# Altium schematic sheet 08_PERIPHERAL.SchDoc
size A4
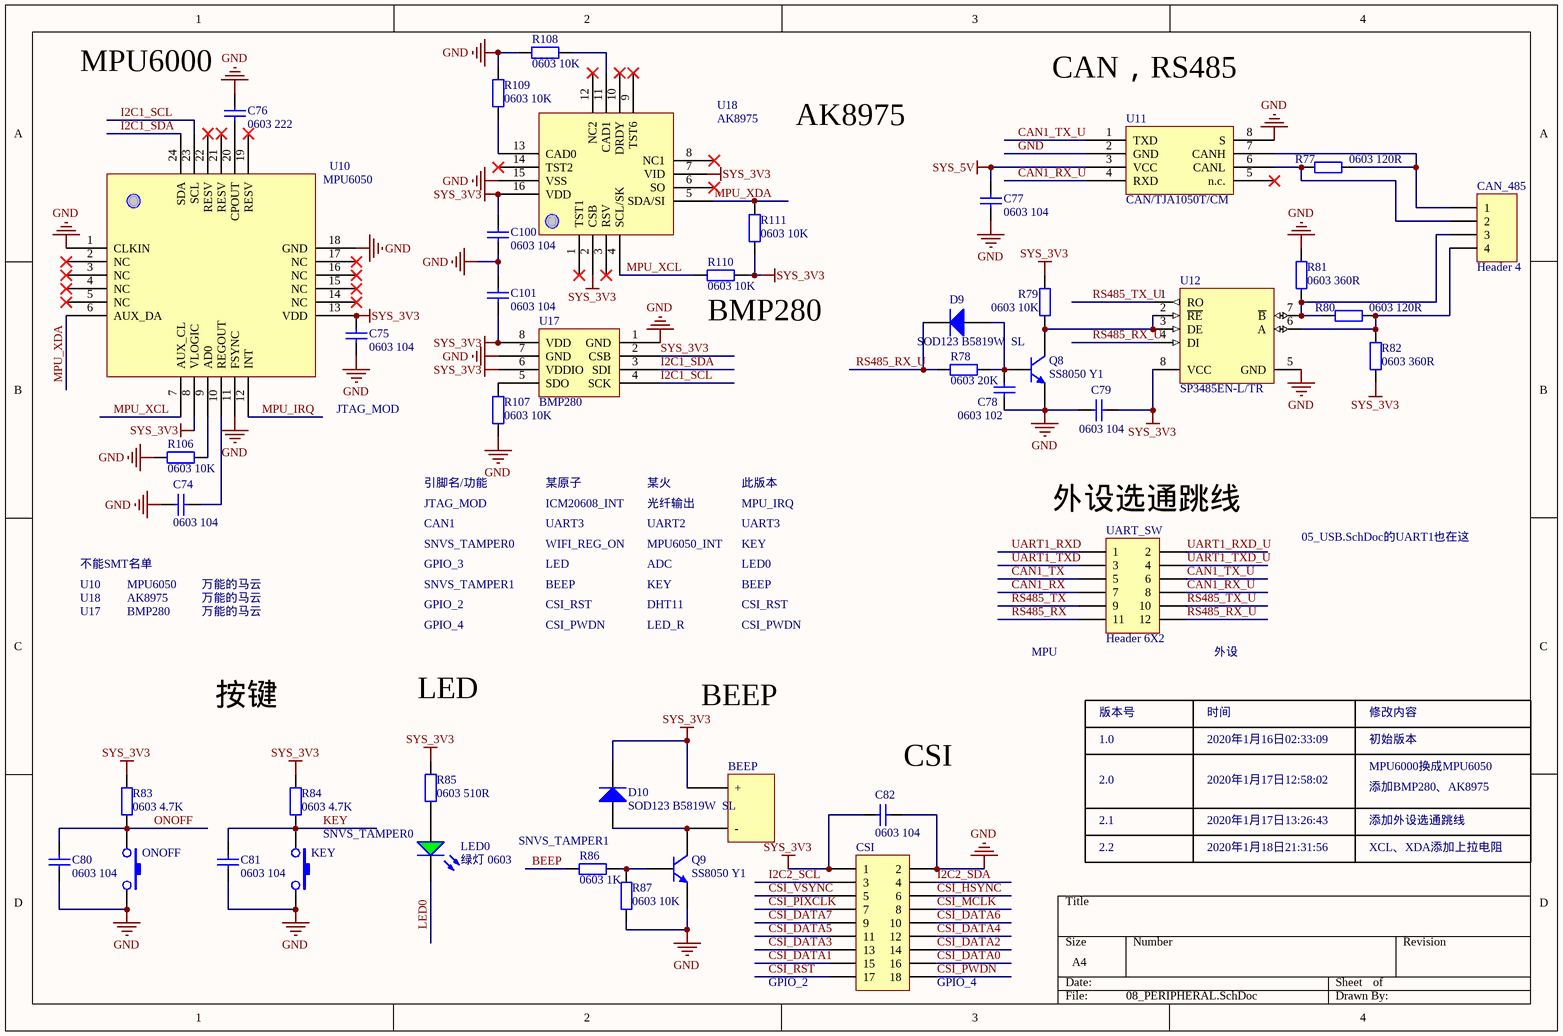
[diagram p0: 08_PERIPHERAL.SchDoc]

## Parts
BEEP  (no value)  [BEEP]
C74  0603 104  [LC-0603_C]
C75  0603 104  [LC-0603_C]
C76  0603 222  [LC-0603_C]
C77  0603 104  [LC-0603_C]
C78  0603 102  [LC-0603_C]
C79  0603 104  [LC-0603_C]
C80  0603 104  [LC-0603_C]
C81  0603 104  [LC-0603_C]
C82  0603 104  [LC-0603_C]
C100  0603 104  [LC-0603_C]
C101  0603 104  [LC-0603_C]
CAN_485  Header 4  [HDR1X4]
CSI  (no value)  [HDR2X9]
D9  SOD123 B5819W  SL  [LC-SOD-123]
D10  SOD123 B5819W  SL  [LC-SOD-123]
KEY  (no value)  [KEY2]
LED0  绿灯 0603  [LC-0603_LED_S1]
ONOFF  (no value)  [KEY2]
Q8  SS8050 Y1  [LC-SOT-23(SOT-23-3)]
Q9  SS8050 Y1  [LC-SOT-23(SOT-23-3)]
R77  0603 120R  [LC-0603_R]
R78  0603 20K  [LC-0603_R]
R79  0603 10K  [LC-0603_R]
R80  0603 120R  [LC-0603_R]
R81  0603 360R  [LC-0603_R]
R82  0603 360R  [LC-0603_R]
R83  0603 4.7K  [LC-0603_R]
R84  0603 4.7K  [LC-0603_R]
R85  0603 510R  [LC-0603_R]
R86  0603 1K  [LC-0603_R]
R87  0603 10K  [LC-0603_R]
R106  0603 10K  [LC-0603_R]
R107  0603 10K  [LC-0603_R]
R108  0603 10K  [LC-0603_R]
R109  0603 10K  [LC-0603_R]
R110  0603 10K  [LC-0603_R]
R111  0603 10K  [LC-0603_R]
U10  MPU6050  [QFN-24_4x4x05P]
U11  CAN/TJA1050T/CM  [LC-SOIC-8_150mil]
U12  SP3485EN-L/TR  [LC-SOIC-8_150mil]
U17  BMP280  [BMP280]
U18  AK8975  [QFN16(4mm)]
UART_SW  Header 6X2  [HDR2X6]

## Nets
GND: C74.1 C75.1 C76.2 C77.1 C78.2 C79.1 C80.1 C81.1 C82.1 C100.2 C101.1 CSI.2 KEY.2 ONOFF.2 Q8.2(E) Q9.2(E) R81.2 R87.2 R106.1 R107.1 R108.2 R109.1 U10.1(CLKIN) U10.11(FSYNC) U10.18(GND) U11.2(GND) U11.8(S) U12.5(GND) U17.1(GND) U17.7(GND) U18.15(VSS)
SYS_3V3: BEEP.+ C75.2 C79.2 C82.2 C100.1 C101.2 CSI.1 D10.2(K) R79.1 R82.1 R83.2 R84.2 R85.2 R110.2 R111.2 U10.8(VLOGIC) U10.13(VDD) U12.8(VCC) U17.2(CSB) U17.6(VDDIO) U17.8(VDD) U18.2(CSB) U18.16(VDD)
SYS_5V: C77.2 U11.3(VCC)
BEEP: R86.2
CAN1_RX: UART_SW.7
CAN1_RX_U: U11.4(RXD) UART_SW.8
CAN1_TX: UART_SW.5
CAN1_TX_U: U11.1(TXD) UART_SW.6
CSI_DATA0: CSI.16
CSI_DATA1: CSI.15
CSI_DATA2: CSI.14
CSI_DATA3: CSI.13
CSI_DATA4: CSI.12
CSI_DATA5: CSI.11
CSI_DATA6: CSI.10
CSI_DATA7: CSI.9
CSI_HSYNC: CSI.6
CSI_MCLK: CSI.8
CSI_PIXCLK: CSI.7
CSI_PWDN: CSI.18
CSI_RST: CSI.17
CSI_VSYNC: CSI.5
I2C1_SCL: U10.23(SCL) U17.4(SCK)
I2C1_SDA: U10.24(SDA) U17.3(SDI)
I2C2_SCL: CSI.3
I2C2_SDA: CSI.4
KEY: C81.2 KEY.1 R84.1
LED0: LED0.K
MPU_IRQ: U10.12(INT)
MPU_XCL: R110.1 U10.7(AUX_CL) U18.4(SCL/SK)
MPU_XDA: R111.1 U10.6(AUX_DA) U18.5(SDA/SI)
ONOFF: C80.2 ONOFF.1 R83.1
RS485_RX: UART_SW.11
RS485_RX_U: D9.2(K) R78.2 U12.4(DI) UART_SW.12
RS485_TX: UART_SW.9
RS485_TX_U: U12.1(RO) UART_SW.10
UART1_RXD: UART_SW.1
UART1_RXD_U: UART_SW.2
UART1_TXD: UART_SW.3
UART1_TXD_U: UART_SW.4
NetBEEP_-: BEEP.- D10.1(A) Q9.3(C)
NetC74_2: C74.2 U10.10(REGOUT)
NetC76_1: C76.1 U10.20(CPOUT)
NetC78_1: C78.1 D9.1(A) Q8.1(B) R78.1
NetCAN_485_1: CAN_485.1 R77.2 U11.7(CANH)
NetCAN_485_2: CAN_485.2 R77.1 U11.6(CANL)
NetCAN_485_3: CAN_485.3 R80.1 R81.1 U12.7(~{B})
NetCAN_485_4: CAN_485.4 R80.2 R82.2 U12.6(A)
NetLED0_A: LED0.A R85.1
NetQ8_3: Q8.3(C) R79.2 U12.2(~{RE}) U12.3(DE)
NetQ9_1: Q9.1(B) R86.1 R87.1
NetR106_2: R106.2 U10.9(AD0)
NetR107_2: R107.2 U17.5(SDO)
NetR108_1: R108.1 U18.11(CAD1)
NetR109_2: R109.2 U18.13(CAD0)

Not connected (* = marked no-connect by the designer): U10 2(NC)* 3(NC)* 4(NC)* 5(NC)* 14(NC)* 15(NC)* 16(NC)* 17(NC)* 19(RESV)* 21(RESV)* 22(RESV)*; U11 5(n.c.)*; U18 1(TST1)* 3(RSV)* 6(SO)* 7(VID) 8(NC1)* 9(TST6)* 10(DRDY)* 12(NC2)* 14(TST2)*

## Notes on the sheet
- (near C76) MPU6000
- CAN，RS485
- AK8975
- (near R110) BMP280
- (near U10) JTAG_MOD
- JTAG_MOD
- 引脚名/功能
- 某原子
- ICM20608_INT
- 某火
- 光纤输出
- 此版本
- MPU_IRQ
- (near UART_SW) 外设选通跳线
- 不能SMT名单
- CAN1
- SNVS_TAMPER0
- GPIO_3
- UART3
- WIFI_REG_ON
- LED
- UART2
- MPU6050_INT
- ADC
- KEY
- LED0
- 05_USB.SchDoc的UART1也在这
- U10
- U18
- U17
- MPU6050
- BMP280
- 万能的马云
- SNVS_TAMPER1
- GPIO_2
- GPIO_4
- BEEP
- CSI_RST
- CSI_PWDN
- DHT11
- LED_R
- MPU
- 外设
- 按键
- 版本号
- 时间
- 修改内容
- (near C82) CSI
- 1.0
- 2.0
- 2020年1月16日02:33:09
- 2020年1月17日12:58:02
- 初始版本
- MPU6000换成MPU6050
- 添加BMP280、AK8975
- (near R86) SNVS_TAMPER1
- 2.1
- 2.2
- 2020年1月17日13:26:43
- 2020年1月18日21:31:56
- 添加外设选通跳线
- XCL、XDA添加上拉电阻
- (near CSI) GPIO_2
- (near CSI) GPIO_4
- Labels drawn without touching a wire or pin: SYS_3V3

## Library data of the parts
BEEP = BEEP
C74-C82 C100 C101 = 0603 1.5nF (152) 10% 50V: 贴片电容; ComponentLink1Description: 供应商链接; ComponentLink1URL: http://www.szlcsc.com/product/details_1947.html; Package: 0603; Supplier: LC; SuppliersPartNumber: C1595
CAN_485 = Header 4: Header, 4-Pin; LatestRevisionDate: 17-Jul-2002; LatestRevisionNote: Re-released for DXP Platform.; Publisher: Altium Limited
CSI = Header 9X2: Header, 9-Pin, Dual row; LatestRevisionDate: 17-Jul-2002; LatestRevisionNote: Re-released for DXP Platform.; Publisher: Altium Limited
D9 D10 = SOD-123 B5819W  SL: 肖特基二极管; ComponentLink1Description: 供应商链接; ComponentLink1URL: http://www.szlcsc.com/product/details_9093.html; Package: SOD-123; Supplier: LC; SuppliersPartNumber: C8598
KEY ONOFF = KEY
LED0 = 0603 绿灯: 发光二极管; ComponentLink1Description: 供应商链接; ComponentLink1URL: http://www.szlcsc.com/product/details_73152.html; Package: 0603; Supplier: LC; SuppliersPartNumber: C72043
Q8 Q9 = SOT-23 SS8050 Y1: 三极管; ComponentLink1Description: 供应商链接; ComponentLink1URL: http://www.szlcsc.com/product/details_2507.html; Package: SOT-23; Supplier: LC; SuppliersPartNumber: C2150
R77-R87 R106-R111 = 0603 1.1KΩ (1101) 1%: 贴片电阻; ComponentLink1Description: 供应商链接; ComponentLink1URL: http://www.szlcsc.com/product/details_23491.html; Package: 0603; Supplier: LC; SuppliersPartNumber: C22764
U11 = CAN/TJA1050T/CM: CAN; ComponentLink1Description: 供应商链接; ComponentLink1URL: http://www.szlcsc.com/product/details_7424.html; Package: SOIC-8_150mil; Supplier: LC; SuppliersPartNumber: C6952
U12 = SP3485EN-L/TR: RS-485/RS-422; ComponentLink1Description: 供应商链接; ComponentLink1URL: http://www.szlcsc.com/product/details_9482.html; Package: SOIC-8; Supplier: LC; SuppliersPartNumber: C8963
UART_SW = Header 6X2: Header, 6-Pin, Dual row; LatestRevisionDate: 17-Jul-2002; LatestRevisionNote: Re-released for DXP Platform.; Publisher: Altium Limited